# EAGLE board Main board V5.0 (EAGLE 6.5.0), part 1 of 2
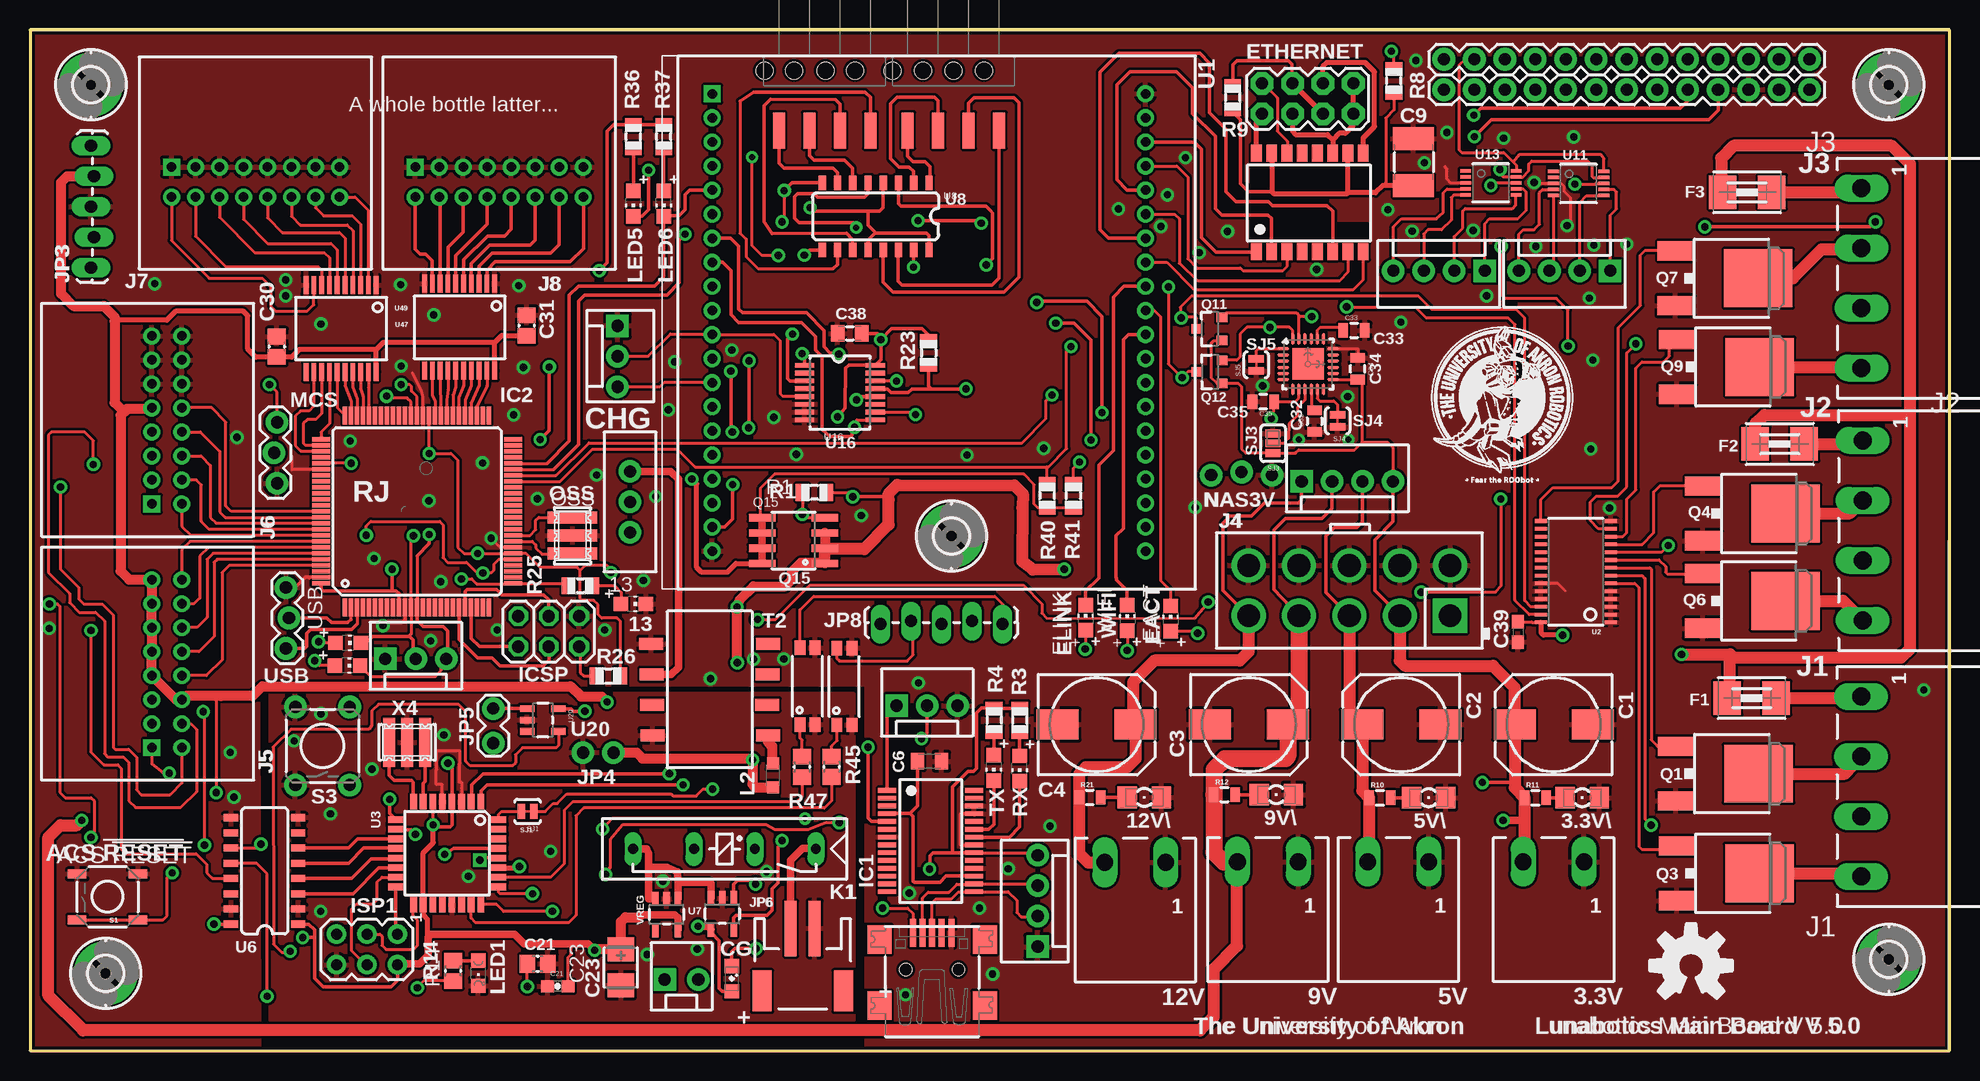
[diagram p7: board, top side]
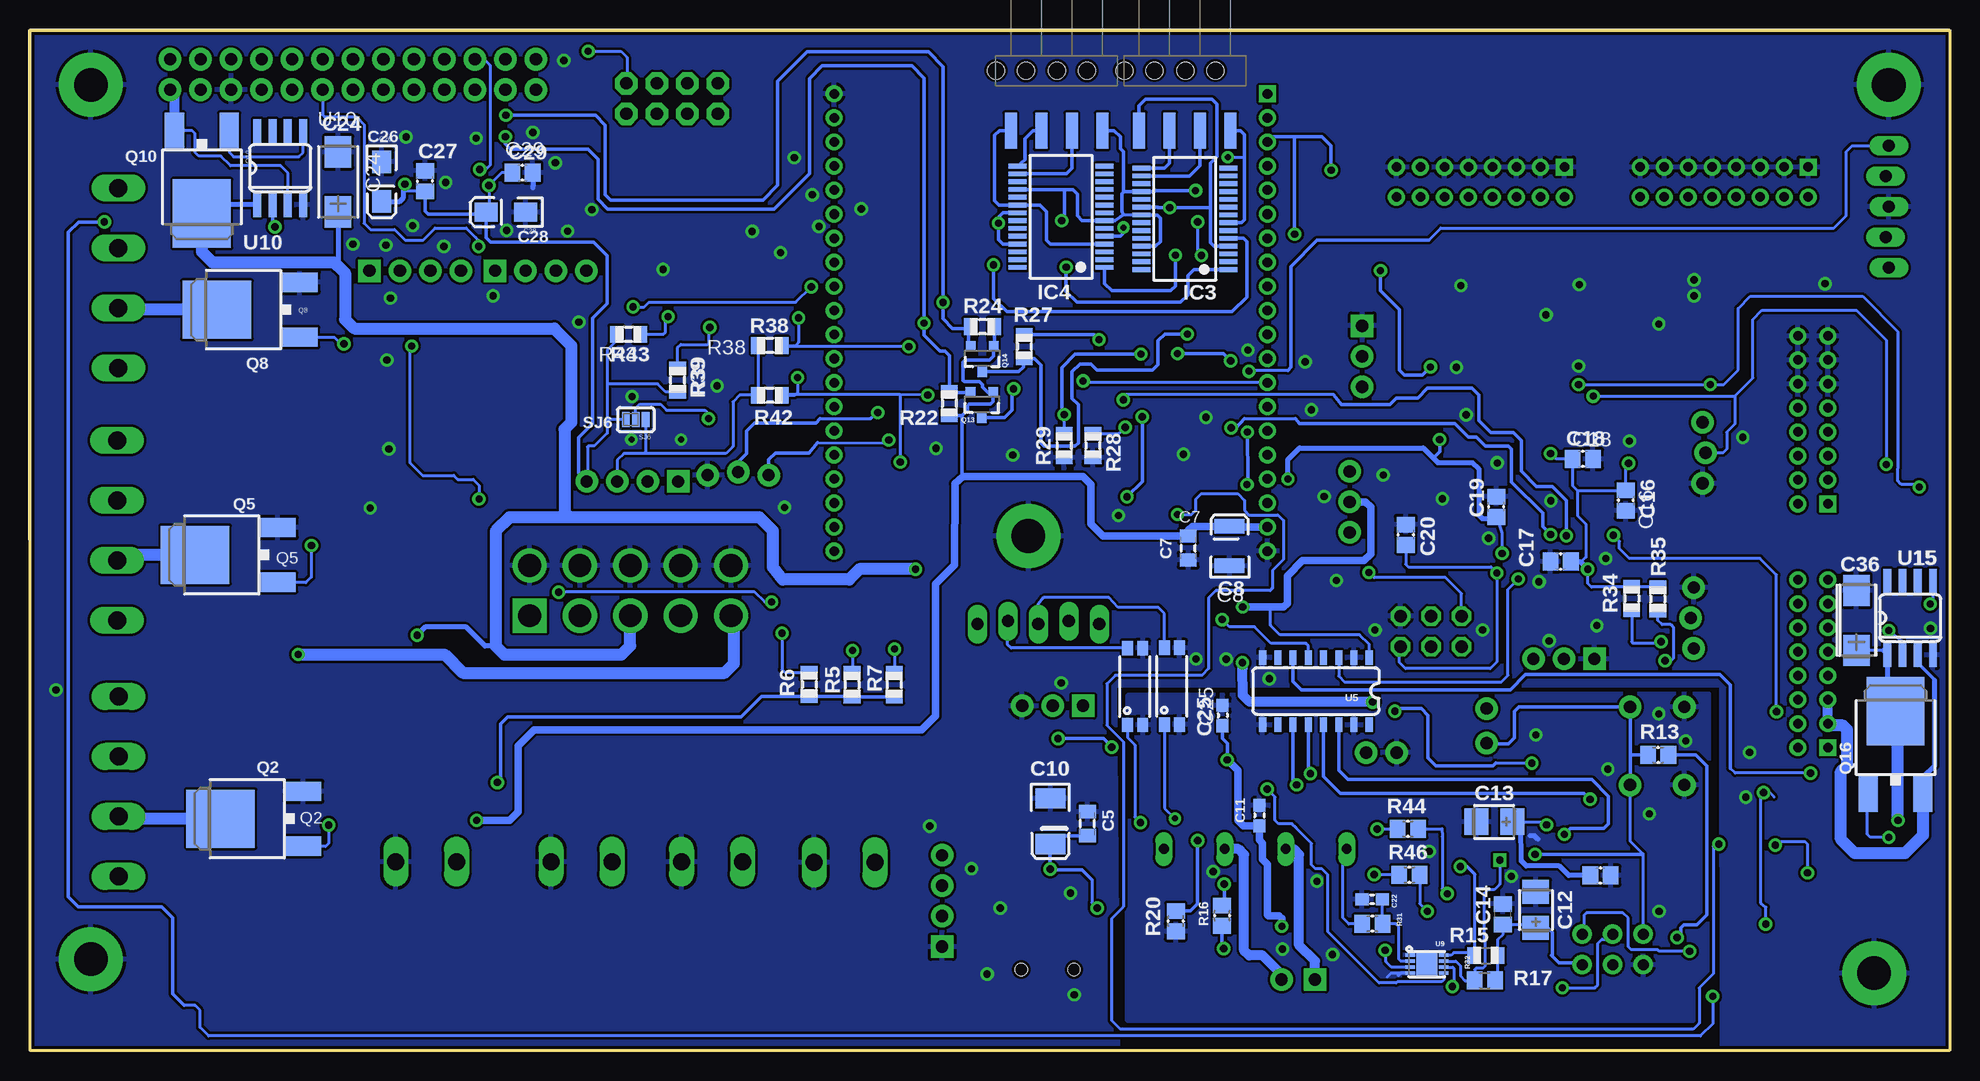
[diagram p8: board, bottom side, seen from below]

Size 160.02 x 85.09 mm. Coordinates in mm from the lower left corner, seen from the top.
Outline: 0,0 160,0 160.02,85.09 0,85.09 0,0
Copper layers (1*16): Top 0.035mm / dielectric 1.5mm / Bottom 0.035mm
Design rules "default": minimum track width 8mil, minimum drill 20mil, track to track 8mil, track to pad 8mil, pad to pad 8mil, via to via 8mil, smd to smd 8mil, copper to edge 10mil, drill to drill 8mil, minimum pad ring 12mil, minimum via ring 10mil, stop-mask expansion 4mil, vias tented up to drill 25mil, thermal gap 10mil
Net classes: 1 power: width 0.61 mm, drill 0.711 mm, clearance 0.203 mm

## Footprints (pad centres in the part's own frame; a part is rotated, then mirrored left to right if it is on the bottom)
M2 = drill 1.4 long: 1 -2.54,0; 2 2.54,0
FKIT-LED-1206 = smd 1.6 x 1.803: A -1.422,0; C 1.422,0
CHIP-LED0805 = smd 1.2 x 1.2: A 0,-1.05; C 0,1.05
140CLH-0810 = smd 3.5 x 2.5: + 3.25,0; - -3.25,0
C0805K = smd 1.1 x 1.4: 1 -1,0; 2 1,0
EIA3528 = smd 1.2 x 2.5: A 1.65,0; C -1.65,0
C1812 = smd 1.9 x 3.4: 1 -1.95,0; 2 1.95,0
EIA3528-KIT = smd 1.7 x 2.5: A 1.9,0; C -1.9,0
C0603 = smd 1.1 x 1: 1 -0.85,0; 2 0.85,0
CT3528 = smd 2 x 2.2: + 1.5,0; - -1.5,0
C0805 = smd 1.3 x 1.5: 1 -0.85,0; 2 0.85,0
0603-CAP = smd 1.1 x 1: 1 -0.85,0; 2 0.85,0
CT6032 = smd 2.6 x 2.2: + 2.5,0; - -2.5,0
EIA3216-KIT = smd 1.9 x 1.6: A 1.65,0; C -1.65,0
0805 = smd 0.8 x 1.2: 1 -0.9,0; 2 0.9,0
SML0805 = smd 1.2 x 1.2: A 1.05,0; C -1.05,0
SWITCH-SPDT = drill 1.016 pad 1.88: 1 0,2.54; 2 0,0; 3 0,-2.54
USB-MINIB = smd 0.5 x 2.308: D+ 0,4.064; D- -0.8,4.064; GND 1.6,4.064; ID 0.8,4.064; VBUS -1.6,4.064 | smd 2 x 2.4: GND1 -4.4,-2; GND2 -4.4,3.5; GND3 4.4,3.5; GND4 4.4,-2 | hole 1: -2.2,1; 2.2,1
2X4 = drill 1.016 pad 1.88 octagon: 1 -3.81,-1.27; 2 -3.81,1.27; 3 -1.27,-1.27; 4 -1.27,1.27; 5 1.27,-1.27; 6 1.27,1.27; 7 3.81,-1.27; 8 3.81,1.27
1812 = smd 2.286 x 2.794: 1 -2.046,0; 2 2.046,0
2,8-PAD = drill 2.8 pad 5.334: B2,8 0,0
SSOP28 = smd 0.4 x 1.5: 1 -4.225,-3.625; 2 -3.575,-3.625; 3 -2.925,-3.625; 4 -2.275,-3.625; 5 -1.625,-3.625; 6 -0.975,-3.625; 7 -0.325,-3.625; 8 0.325,-3.625; 9 0.975,-3.625; 10 1.625,-3.625; 11 2.275,-3.625; 12 2.925,-3.625; 13 3.575,-3.625; 14 4.225,-3.625; 15 4.225,3.625; 16 3.575,3.625; 17 2.925,3.625; 18 2.275,3.625; 19 1.625,3.625; 20 0.975,3.625; 21 0.325,3.625; 22 -0.325,3.625; 23 -0.975,3.625; 24 -1.625,3.625; 25 -2.275,3.625; 26 -2.925,3.625; 27 -3.575,3.625; 28 -4.225,3.625
TQFP100 = smd 1.5 x 0.35: 1 -8,6; 2 -8,5.5; 3 -8,5; 4 -8,4.5; 5 -8,4; 6 -8,3.5; 7 -8,3; 8 -8,2.5; 9 -8,2; 10 -8,1.5; 11 -8,1; 12 -8,0.5; 13 -8,0; 14 -8,-0.5; 15 -8,-1; 16 -8,-1.5; 17 -8,-2; 18 -8,-2.5; 19 -8,-3; 20 -8,-3.5; 21 -8,-4; 22 -8,-4.5; 23 -8,-5; 24 -8,-5.5; 25 -8,-6; 51 8,-6; 52 8,-5.5; 53 8,-5; 54 8,-4.5; 55 8,-4; 56 8,-3.5; 57 8,-3; 58 8,-2.5; 59 8,-2; 60 8,-1.5; 61 8,-1; 62 8,-0.5; 63 8,0; 64 8,0.5; 65 8,1; 66 8,1.5; 67 8,2; 68 8,2.5; 69 8,3; 70 8,3.5; 71 8,4; 72 8,4.5; 73 8,5; 74 8,5.5; 75 8,6 | smd 0.35 x 1.5: 26 -6,-8; 27 -5.5,-8; 28 -5,-8; 29 -4.5,-8; 30 -4,-8; 31 -3.5,-8; 32 -3,-8; 33 -2.5,-8; 34 -2,-8; 35 -1.5,-8; 36 -1,-8; 37 -0.5,-8; 38 0,-8; 39 0.5,-8; 40 1,-8; 41 1.5,-8; 42 2,-8; 43 2.5,-8; 44 3,-8; 45 3.5,-8; 46 4,-8; 47 4.5,-8; 48 5,-8; 49 5.5,-8; 50 6,-8; 76 6,8; 77 5.5,8; 78 5,8; 79 4.5,8; 80 4,8; 81 3.5,8; 82 3,8; 83 2.5,8; 84 2,8; 85 1.5,8; 86 1,8; 87 0.5,8; 88 0,8; 89 -0.5,8; 90 -1,8; 91 -1.5,8; 92 -2,8; 93 -2.5,8; 94 -3,8; 95 -3.5,8; 96 -4,8; 97 -4.5,8; 98 -5,8; 99 -5.5,8; 100 -6,8
2X03 = drill 1.016 octagon: 1 -2.54,-1.27; 2 -2.54,1.27; 3 0,-1.27; 4 0,1.27; 5 2.54,-1.27; 6 2.54,1.27
AVRISP = drill 0.9 pad 1.626: 1 -1.27,2.54; 2 1.27,2.54; 3 -1.27,0; 4 1.27,0; 5 -1.27,-2.54; 6 1.27,-2.54
M4 = drill 1.5 long: 1 0,0; 2 5,0; 3 10,0; 4 15,0
0874271042 = drill 1.9 square: 1 8.4,-2.1 | drill 1.9: 2 4.2,-2.1; 3 0,-2.1; 4 -4.2,-2.1; 5 -8.4,-2.1; 6 8.4,2.1; 7 4.2,2.1; 8 0,2.1; 9 -4.2,2.1; 10 -8.4,2.1
0559591630 = drill 0.8 square: 1 -7,0 | drill 0.8: 2 -5,0; 3 -3,0; 4 -1,0; 5 1,0; 6 3,0; 7 5,0; 8 7,0; 9 -7,-2.5; 10 -5,-2.5; 11 -3,-2.5; 12 -1,-2.5; 13 1,-2.5; 14 3,-2.5; 15 5,-2.5; 16 7,-2.5
MOLEX-1X3 = drill 1.016 pad 1.88 square: 1 0,0 | drill 1.016 pad 1.88: 2 2.54,0; 3 5.08,0
1X05_LOCK_LONGPADS = drill 1.016 long: 1 0,0; 2 2.54,-0.254; 3 5.08,0; 4 7.62,-0.254; 5 10.16,0
1X02_NO_SILK = drill 1.016 pad 1.88: 1 0,0; 2 2.54,0
1X02_LOCK = drill 1.016 pad 1.88: 1 -0.178,0; 2 2.718,0
JST-2-SMD = smd 1 x 4.6: 1 -1,-3.7; 2 1,-3.7 | smd 1.6 x 3.4: NC1 -3.4,1.5; NC2 3.4,1.5
1X13 = drill 1.016 pad 1.88: 1 0,0; 2 2.54,0; 3 5.08,0; 4 7.62,0; 5 10.16,0; 6 12.7,0; 7 15.24,0; 8 17.78,0; 9 20.32,0; 10 22.86,0; 11 25.4,0; 12 27.94,0; 13 30.48,0
MOLEX-1X4 = drill 1.016 pad 1.88 square: 1 0,0 | drill 1.016 pad 1.88: 2 2.54,0; 3 5.08,0; 4 7.62,0
MOLEX-1X2_LOCK = drill 1.016 pad 1.88 square: 1 -0.127,0 | drill 1.016 pad 1.88: 2 2.667,0
1X04-SMD = smd 1 x 3: 1 -3.81,5; 2 -1.27,5; 3 1.27,5; 4 3.81,5 | hole 1.4: -2.54,0; 2.54,0
REED = drill 0.813 long: 1 -17.78,2.54; 3 -12.7,2.54; 5 -7.62,2.54; 7 -2.54,2.54
L2012C = smd 1 x 1: 1 -1,0; 2 1,0
CHIPLED_0805 = smd 1.2 x 1.2: A 0,-1.05; C 0,1.05
1X03_LOCK = drill 1.016 pad 1.88: 1 0,0.127; 2 2.54,-0.127; 3 5.08,0.127
1X03_LOCK_NO_SILK = drill 1.016 pad 1.88: 1 0,0.127; 2 2.54,-0.127; 3 5.08,0.127
AWCSR = smd 1 x 4.1: 1 -1.5,0; 2 0,0; 3 1.5,0
DPAK = smd 1.6 x 3: 1 -2.28,-5.31; 3 2.28,-5.31 | smd 4.826 x 5.715: 4 0,1.588
SOT23-3 = smd 0.8 x 0.9: 1 -0.95,-1; 2 0.95,-1; 3 0,1.1
SO08 = smd 0.61 x 2.21: 1 -1.905,-2.616; 2 -0.635,-2.616; 3 0.635,-2.616; 4 1.905,-2.616; 5 1.905,2.616; 6 0.635,2.616; 7 -0.635,2.616; 8 -1.905,2.616
R0805 = smd 1.1 x 1.4: 1 -1,0; 2 1,0
R0805' = smd 1.3 x 1.5: 1 -0.85,0; 2 0.85,0
TACTILE_SWITCH_SMD = smd 1.524 x 0.762: 1 -2.54,1.905; 2 2.54,1.905; 3 -2.54,-1.905; 4 2.54,-1.905
TACTILE-PTH = drill 1.016 pad 1.88: 1 -3.251,2.261; 2 3.251,2.261; 3 -3.251,-2.261; 4 3.251,-2.261
SJ_2S-TRACE = smd 0.635 x 1.27: 1 -0.508,0; 2 0.508,0
SJ_3_PASTE2&3 = smd 0.635 x 1.27: 1 -0.813,0; 2 0,0; 3 0.813,0
SO-8FT = smd 1 x 2: 1 -3.81,-4.91; 3 -1.27,-4.88; 5 1.27,-4.85; 7 3.81,-4.81; 8 3.81,4.81; 10 1.27,4.75; 12 -1.27,4.78; 14 -3.81,4.81
LANA/BTH = drill 0.8 square: 1 -18.059,19.063 | drill 0.8: 2 18.059,19.063; 3 -18.059,17.056; 4 18.059,17.056; 5 -18.059,15.05; 6 18.059,15.05; 7 -18.059,13.043; 8 18.059,13.043; 9 -18.059,11.036; 10 18.059,11.036; 11 -18.059,9.03; 12 18.059,9.03; 13 -18.059,7.023; 14 18.059,7.023; 15 -18.059,5.016; 16 18.059,5.016; 17 -18.059,3.01; 18 18.059,3.01; 19 -18.059,1.003; 20 18.059,1.003; 21 -18.059,-1.003; 22 18.059,-1.003; 23 -18.059,-3.01; 24 18.059,-3.01; 25 -18.059,-5.016; 26 18.059,-5.016; 27 -18.059,-7.023; 28 18.059,-7.023; 29 -18.059,-9.03; 30 18.059,-9.03; 31 -18.059,-11.036; 32 18.059,-11.036; 33 -18.059,-13.043; 34 18.059,-13.043; 35 -18.059,-15.05; 36 18.059,-15.05; 37 -18.059,-17.056; 38 18.059,-17.056; 39 -18.059,-19.063; 40 18.059,-19.063
TSSOP28 = smd 0.305 x 0.991: 1 -4.225,-2.918; 2 -3.575,-2.918; 3 -2.925,-2.918; 4 -2.275,-2.918; 5 -1.625,-2.918; 6 -0.975,-2.918; 7 -0.325,-2.918; 8 0.325,-2.918; 9 0.975,-2.918; 10 1.625,-2.918; 11 2.275,-2.918; 12 2.925,-2.918; 13 3.575,-2.918; 14 4.225,-2.918; 15 4.225,2.918; 16 3.575,2.918; 17 2.925,2.918; 18 2.275,2.918; 19 1.625,2.918; 20 0.975,2.918; 21 0.325,2.918; 22 -0.325,2.918; 23 -0.975,2.918; 24 -1.625,2.918; 25 -2.275,2.918; 26 -2.925,2.918; 27 -3.575,2.918; 28 -4.225,2.918
TQFP32-08 = smd 1.27 x 0.559: 1 -4.293,2.8; 2 -4.293,2; 3 -4.293,1.2; 4 -4.293,0.4; 5 -4.293,-0.4; 6 -4.293,-1.2; 7 -4.293,-2; 8 -4.293,-2.8; 17 4.293,-2.8; 18 4.293,-2; 19 4.293,-1.2; 20 4.293,-0.4; 21 4.293,0.4; 22 4.293,1.2; 23 4.293,2; 24 4.293,2.8 | smd 0.559 x 1.27: 9 -2.8,-4.293; 10 -2,-4.293; 11 -1.2,-4.293; 12 -0.4,-4.293; 13 0.4,-4.293; 14 1.2,-4.293; 15 2,-4.293; 16 2.8,-4.293; 25 2.8,4.293; 26 2,4.293; 27 1.2,4.293; 28 0.4,4.293; 29 -0.4,4.293; 30 -1.2,4.293; 31 -2,4.293; 32 -2.8,4.293
S016 = smd 0.6 x 1.2: 1 -4.445,-2.8; 2 -3.175,-2.8; 3 -1.905,-2.8; 4 -0.635,-2.8; 5 0.635,-2.8; 6 1.905,-2.8; 7 3.175,-2.8; 8 4.445,-2.8; 9 4.445,2.8; 10 3.175,2.8; 11 1.905,2.8; 12 0.635,2.8; 13 -0.635,2.8; 14 -1.905,2.8; 15 -3.175,2.8; 16 -4.445,2.8
SOT23-5 = smd 0.55 x 1.2: 1 -0.95,-1.3; 2 0,-1.3; 3 0.95,-1.3; 4 0.95,1.3; 5 -0.95,1.3
TDFN-8 = smd 0.8 x 0.3: 1 -1.4,0.75; 2 -1.4,0.25; 3 -1.4,-0.25; 4 -1.4,-0.75; 5 1.4,-0.75; 6 1.4,-0.25; 7 1.4,0.25; 8 1.4,0.75 | smd 1.73 x 1.88: EP 0,0
SO08' = smd 0.66 x 2.032: 1 -1.905,-3.073; 2 -0.635,-3.073; 3 0.635,-3.073; 4 1.905,-3.073; 5 1.905,3.073; 6 0.635,3.073; 7 -0.635,3.073; 8 -1.905,3.073
MSOP-10 = smd 0.305 x 0.889: 1 -1,-2.11; 2 -0.5,-2.11; 3 0,-2.11; 4 0.5,-2.11; 5 1,-2.11; 6 1,2.11; 7 0.5,2.11; 8 0,2.11; 9 -0.5,2.11; 10 -1,2.11
QFN-24-4MM2 = smd 1.016 x 0.254: 1 -2.066,1.257; 2 -2.066,0.75; 3 -2.066,0.247; 4 -2.066,-0.287; 5 -2.066,-0.792; 6 -2.066,-1.297; 13 2.086,-1.297; 14 2.086,-0.792; 15 2.086,-0.287; 16 2.086,0.247; 17 2.086,0.75; 18 2.086,1.257 | smd 0.254 x 1.016: 7 -1.267,-2.122; 8 -0.762,-2.122; 9 -0.258,-2.122; 10 0.278,-2.122; 11 0.78,-2.122; 12 1.287,-2.122; 19 1.287,2.082; 20 0.78,2.082; 21 0.278,2.082; 22 -0.258,2.082; 23 -0.762,2.082; 24 -1.267,2.082 | smd 2.616 x 2.616: P$1 0.02,-0.01
TSSOP-16 = smd 0.4 x 1.6: 1 -2.225,-2.85; 2 -1.575,-2.85; 3 -0.925,-2.85; 4 -0.275,-2.85; 5 0.375,-2.85; 6 1.025,-2.85; 7 1.675,-2.85; 8 2.325,-2.85; 9 2.325,3.05; 10 1.675,3.05; 11 1.025,3.05; 12 0.375,3.05; 13 -0.275,3.05; 14 -0.925,3.05; 15 -1.575,3.05; 16 -2.225,3.05
SOT23-5L = smd 0.55 x 1.2: 1 -0.95,-1.3; 2 0,-1.3; 3 0.95,-1.3; 4 0.95,1.3; 5 -0.95,1.3
SSOP-20 = smd 0.4 x 1.5: 1 -2.925,-3.625; 2 -2.275,-3.625; 3 -1.625,-3.625; 4 -0.975,-3.625; 5 -0.325,-3.625; 6 0.325,-3.625; 7 0.975,-3.625; 8 1.625,-3.625; 9 2.275,-3.625; 10 2.925,-3.625; 11 2.925,3.625; 12 2.275,3.625; 13 1.625,3.625; 14 0.975,3.625; 15 0.325,3.625; 16 -0.325,3.625; 17 -0.975,3.625; 18 -1.625,3.625; 19 -2.275,3.625; 20 -2.925,3.625
SSOP-4 = smd 1.2 x 0.9: 1 -3.2,0.67; 2 -3.2,-0.6; 3 3.2,-0.6; 4 3.2,0.67
SO-16MOD = smd 1.4 x 0.9: 1 -4.11,4.445; 2 -4.11,3.175; 3 -4.11,1.905; 4 -4.11,0.635; 5 -4.11,-0.635; 6 -4.11,-1.905; 7 -4.11,-3.175; 8 -4.11,-4.445; 9 4.11,-4.445; 10 4.11,-3.175; 11 4.11,-1.905; 12 4.11,-0.635; 13 4.11,0.635; 14 4.11,1.905; 15 4.11,3.175; 16 4.11,4.445

## Placement (x,y rotation side)
3.3V  [M2]  127,15.75 180 top
3.3V\  [FKIT-LED-1206]  129.39,21.08 0 top
5V  [M2]  114.05,15.75 180 top
5V\  [FKIT-LED-1206]  116.59,21.08 0 top
9V  [M2]  103.17,15.75 180 top
9V\  [FKIT-LED-1206]  103.89,21.34 0 top
12V  [M2]  92.13,15.7 180 top
12V\  [FKIT-LED-1206]  92.89,21.11 0 top
13  [CHIP-LED0805]  50.29,37.24 270 top
C1  330uF  [140CLH-0810]  127,27.18 180 top
C2  330uF  [140CLH-0810]  114.3,27.18 180 top
C3  330uf  [140CLH-0810]  101.6,27.18 0 top
C4  330uF  [140CLH-0810]  88.9,27.18 0 top
C5  0.1uF  [C0805K]  71.88,18.92 90 bottom
C6  0.1uF  [C0805K]  74.98,24.13 0 top
C7  0.1uf  [C0805K]  63.47,41.91 270 bottom
C8  10uf  [EIA3528]  60.02,42.06 90 bottom
C9  1000pF  [C1812]  115.32,74.07 270 top
C10  10uF  [EIA3528-KIT]  74.96,19.13 270 bottom
C11  4.7uF  [C0603]  57.53,19.58 90 bottom
C12  0.1uF  [CT3528]  34.51,11.72 270 bottom
C13  0.1uF  [CT3528]  37.97,19.08 0 bottom
C14  0.1uF  [C0805]  37.26,11.37 90 bottom
C15  0.1uF  [C0805]  29.11,14.59 0 bottom
C16  100n  [C0805]  27,45.87 270 bottom
C17  100n  [C0805]  32.44,40.77 180 bottom
C18  100n  [C0805]  30.58,49.33 0 bottom
C19  100n  [C0805]  37.8,45.34 90 bottom
C20  22p  [C0805]  45.34,43 90 bottom
C21  10nF  [0603-CAP]  43.99,5.36 180 top
C22  1uF  [C0603]  48.13,12.62 180 bottom
C23  10uF  [CT3528]  49.25,6.93 90 top
C24  10uF  [CT6032]  134.34,72.42 270 bottom
C25  4.7uF  [C0603]  60.6,27.94 90 bottom
C26  10uF  [EIA3216-KIT]  130.71,72.44 270 bottom
C27  0.1uF  [C0805]  127.1,72.49 90 bottom
C28  10uF  [EIA3216-KIT]  120.35,69.9 180 bottom
C29  0.1uF  [C0805]  118.97,73.2 0 bottom
C30  0.1uF  [C0805]  20.57,58.67 90 top
C31  0.1uF  [C0805]  41.4,60.45 90 top
C32  0.1uF  [0805]  107.07,52.48 270 top
C33  2.2nF  [0805]  110.36,60.05 0 top
C34  0.1uF  [0805]  110.67,56.85 90 top
C35  10nF  [0805]  102.79,54.1 180 top
C36  10uF  [CT6032]  7.77,35.86 270 bottom
C38  0.1uf  [C0805K]  68.33,59.79 180 top
C39  0.1uF  [C0603]  124,34.9 270 top
CG  RED  [SML0805]  58.5,5.99 270 top
CHG  [SWITCH-SPDT]  50.01,45.75 180 top
CN1  [USB-MINIB]  75.2,5.76 0 top
EACT  [CHIP-LED0805]  95.07,36.02 0 top
ELINK  [CHIP-LED0805]  87.99,36.09 0 top
ETHERNET  M04X2  [2X4]  106.5,79.38 0 top
F1  1A  [1812]  143.51,29.39 0 top
F2  1A  [1812]  145.85,50.57 0 top
F3  1A  [1812]  143.13,71.55 0 top
H2  MOUNT-PAD-ROUND2.8  [2,8-PAD]  154.94,7.62 0 top
H4  MOUNT-PAD-ROUND2.8  [2,8-PAD]  76.81,42.9 0 top
H5  MOUNT-PAD-ROUND2.8  [2,8-PAD]  5.08,80.52 0 top
H6  MOUNT-PAD-ROUND2.8  [2,8-PAD]  154.94,80.52 0 top
H10  MOUNT-PAD-ROUND2.8  [2,8-PAD]  6.3,6.45 0 top
IC1  FT232RL  [SSOP28]  75.08,17.48 270 top
IC2  ATMEGA1280-16AU  [TQFP100]  32.26,44.96 90 top
IC3  FT232RL  [SSOP28]  63.75,69.34 90 bottom
IC4  FT232RL  [SSOP28]  74.07,69.52 90 bottom
ICSP  ICSP  [2X03]  43.23,34.95 0 top
ISP1  AVRISP-6  [AVRISP]  28.09,8.43 270 top
J1  EUROMAG-4  [M4]  152.63,29.51 270 top
J2  EUROMAG-4  [M4]  152.76,50.86 270 top
J3  EUROMAG-4  [M4]  152.65,71.91 270 top
J4  0874271042  [0874271042]  109.98,38.35 0 top
J5  0559591630  [0559591630]  10.16,32.26 90 top
J6  0559591630  [0559591630]  10.16,52.58 90 top
J7  0559591630  [0559591630]  18.8,73.66 0 top
J8  0559591630  [0559591630]  39.12,73.66 0 top
JP1  [MOLEX-1X3]  72.24,28.75 0 top
JP3  [1X05_LOCK_LONGPADS]  5.08,65.28 90 top
JP4  [1X02_NO_SILK]  48.64,24.84 180 top
JP5  [1X02_LOCK]  38.61,28.35 270 top
JP6  [JST-2-SMD]  64.41,6.48 180 top
JP8  [1X05_LOCK_LONGPADS]  81.05,35.56 180 top
JP9  M13  [1X13]  117.86,82.65 0 top
JP10  [MOLEX-1X4]  83.99,8.67 90 top
JP11  [MOLEX-1X4]  105.99,47.45 0 top
JP12  [MOLEX-1X2_LOCK]  53.04,5.92 0 top
JP13  [1X04-SMD]  63.75,81.71 180 bottom
JP14  [1X04-SMD]  74.45,81.69 180 bottom
JP15  [1X04-SMD]  76.96,81.71 180 top
JP16  [1X04-SMD]  66.24,81.71 180 top
JP17  [MOLEX-1X4]  131.72,65.02 180 top
JP18  [MOLEX-1X4]  121.26,65.02 180 top
K1  SIL24-1A72-71L  [REED]  47.73,19.35 180 top
L2  47uH  [L2012C]  61.93,22.96 90 top
LANNAS  [MOLEX-1X3]  48.97,60.43 270 top
LED1  [CHIPLED_0805]  37.36,6.45 180 top
LED3  RED  [CHIP-LED0805]  26.52,33.99 270 top
LED4  GREEN  [CHIP-LED0805]  26.47,32.11 270 top
LED5  RED  [CHIP-LED0805]  50.29,70.61 180 top
LED6  GREEN  [CHIP-LED0805]  52.83,70.61 180 top
MCS  [1X03_LOCK]  20.47,52.37 270 top
NAS  [MOLEX-1X3]  29.62,32.66 0 top
NAS3V  [1X03_LOCK_NO_SILK]  103.53,48.11 180 top
OSS  16Mhz  [AWCSR]  45.21,42.93 90 top
Q1  STB16NF06LT4  [DPAK]  142.49,23.09 270 top
Q2  STB16NF06LT4  [DPAK]  142.54,19.33 90 bottom
Q3  NCH  [DPAK]  142.57,14.78 270 top
Q4  NCH  [DPAK]  144.75,44.78 270 top
Q5  NCH  [DPAK]  144.68,41.33 90 bottom
Q6  NCH  [DPAK]  144.73,37.49 270 top
Q7  NCH  [DPAK]  142.47,64.39 270 top
Q8  NCH  [DPAK]  142.85,61.77 90 bottom
Q9  NCH  [DPAK]  142.6,57 270 top
Q10  MOSFET-NCHANNELFDD8580  [DPAK]  145.69,71.37 180 bottom
Q11  BSS138  [SOT23-3]  98.35,60.17 90 top
Q12  BSS138  [SOT23-3]  98.37,56.59 90 top
Q13  BSS138  [SOT23-3]  80.67,53.87 180 bottom
Q14  BSS138  [SOT23-3]  80.64,57.71 180 bottom
Q15  MOSFET-P  [SO08]  63.65,42.52 90 top
Q16  MOSFET-NCHANNELFDD8580  [DPAK]  4.52,26.72 0 bottom
R1  10k  [R0805]  65.38,46.53 180 top
R3  1K  [R0805]  82.5,27.53 270 top
R4  1K  [R0805]  80.37,27.53 270 top
R5  182  [R0805]  91.49,30.51 90 bottom
R6  182  [R0805]  95.07,30.53 90 bottom
R7  182  [R0805]  87.99,30.51 90 bottom
R8  75  [R0805]  113.69,80.85 270 top
R9  75  [R0805]  100.25,79.45 270 top
R10  1k  [0805]  112.52,21.08 0 top
R11  330  [0805]  125.48,21.08 0 top
R12  1k  [0805]  99.57,21.34 0 top
R13  10k  [R0805']  24.31,24.64 0 bottom
R14  330  [R0805']  35.28,6.65 90 top
R15  2k  [R0805]  38.66,7.93 0 bottom
R16  330  [R0805']  60.66,11.25 90 bottom
R17  2k  [R0805']  38.76,5.84 0 bottom
R20  10k  [R0805']  64.52,10.8 90 bottom
R21  2k  [0805]  88.34,21.11 0 top
R22  10k  [R0805]  83.39,53.95 270 bottom
R23  10k  [R0805]  74.9,58.17 90 top
R24  10k  [R0805]  80.62,60.35 0 bottom
R25  1k  [R0805]  45.87,38.76 0 top
R26  10k  [R0805]  48.21,31.24 0 top
R27  10k  [R0805]  77.14,58.7 90 bottom
R28  10K  [R0805]  71.42,50.44 270 bottom
R29  10K  [R0805]  73.81,50.44 270 bottom
R31  1k  [R0805']  48.13,10.57 180 bottom
R32  4.7k  [R0805']  42.32,7.24 180 top
R34  1k  [R0805]  26.52,37.69 90 bottom
R35  1k  [R0805]  24.33,37.64 90 bottom
R36  1k  [R0805]  50.29,76.2 90 top
R37  1k  [R0805]  52.83,76.2 90 top
R38  10k  [R0805]  98.35,58.78 180 bottom
R39  10k  [R0805]  106.05,55.91 270 bottom
R40  2k  [R0805]  84.79,46.25 90 top
R41  2k  [R0805]  86.97,46.25 90 top
R42  10k  [R0805]  98.35,54.64 180 bottom
R43  10k  [R0805]  110.13,59.72 180 bottom
R44  [R0805']  45.16,18.49 0 bottom
R45  [R0805']  66.83,23.67 270 top
R46  [R0805']  45.03,14.66 0 bottom
R47  [R0805']  64.36,23.65 270 top
RASPBERRYPI  RASPBERRY PI  [1X13]  117.86,80.11 0 top
RX  Green  [CHIP-LED0805]  82.5,23.52 180 top
S1  [TACTILE_SWITCH_SMD]  6.47,12.82 180 top
S3  [TACTILE-PTH]  24.38,25.4 90 top
SJ1  SOLDERJUMPERTRACE  [SJ_2S-TRACE]  41.48,19.94 180 top
SJ3  [SJ_3_PASTE2&3]  103.61,50.63 90 top
SJ4  [SJ_2S-TRACE]  108.99,52.5 90 top
SJ5  [SJ_2S-TRACE]  102.21,57.18 90 top
SJ6  [SJ_3_PASTE2&3]  109.52,52.6 180 bottom
T2  NTE0505MC  [SO-8FT]  56.69,30.1 270 top
TX  Red  [CHIP-LED0805]  80.34,23.57 180 top
U1  LANTRONIX_B/G  [LANA/BTH]  74.93,60.71 0 top
U2  [TSSOP28]  128.85,39.93 90 top
U3  ATMEGA328  [TQFP32-08]  34.77,16.46 270 top
U5  IL715  [S016]  52.83,29.97 180 bottom
U6  IL715  [S016]  19.56,14.99 90 top
U7  MCP73831  [SOT23-5]  57.71,11.4 180 top
U8  SN751178  [S016]  70.48,69.55 180 top
U9  MAX17043G+U  [TDFN-8]  43.59,7.21 0 bottom
U10  MIC5014  [SO08']  139.17,73.58 0 bottom
U11  ADS1015  [MSOP-10]  129.08,72.29 270 top
U12  MPU-6050-1  [QFN-24-4MM2]  106.53,57.25 0 top
U13  ADS1015  [MSOP-10]  121.77,72.34 270 top
U15  MIC5014  [SO08']  3.3,36.07 0 bottom
U16  CD74HC4052PWR  [TSSOP-16]  67.41,54.91 270 top
U20  MAX823  [SOT23-5L]  42.75,27.56 270 top
U47  MAX6818  [SSOP-20]  25.93,60.2 180 top
U49  MAX6818  [SSOP-20]  35.81,60.3 180 top
U$3  OSHW-LOGOL  [OSHW-LOGO-L]  138.46,7.09 0 top
U$16  TCMT1103-OPTO  [SSOP-4]  67.92,30.35 90 top
U$17  TCMT1103-OPTO  [SSOP-4]  64.85,30.38 90 top
U$18  TCMT1103-OPTO  [SSOP-4]  64.8,30.38 90 bottom
U$19  TCMT1103-OPTO  [SSOP-4]  67.87,30.35 90 bottom
USB  [1X03_LOCK]  21.46,33.53 90 top
VREG  MIC5205-3.3V  [SOT23-5]  53.06,11.35 180 top
WIFI  [CHIP-LED0805]  91.47,36.07 0 top
X1  TLA-6T118LF  [SO-16MOD]  106.68,70.71 90 top
X4  [AWCSR]  31.45,25.7 180 top